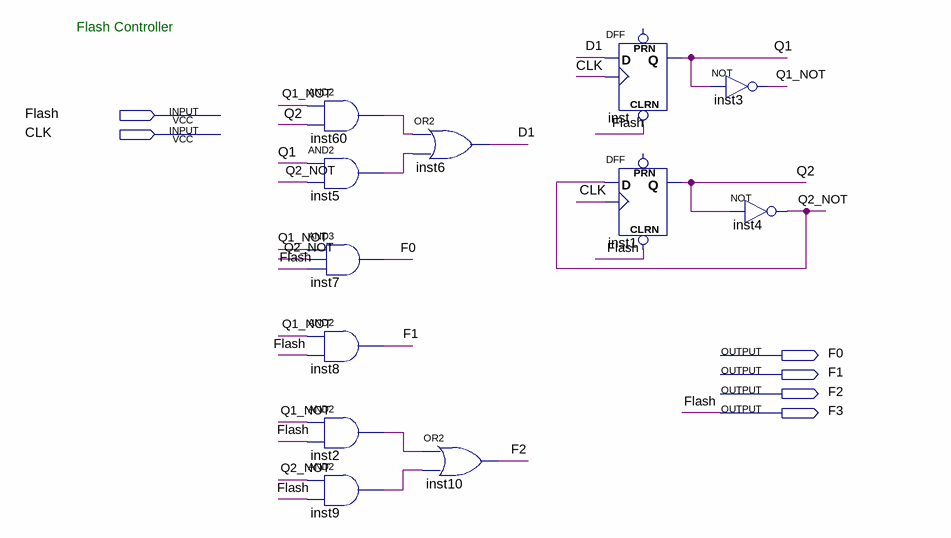
[diagram p0: schematic sheet]
// Quartus schematic FlashController.bdf as structural Verilog: 12 symbols, 6 pins
module FlashController (
  input  Flash,
  input  CLK,
  output F0,
  output F1,
  output F2,
  output F3
);

  wire D1, inst2_out, inst5_out, inst9_out, inst60_out, Q1, Q1_NOT, Q2, Q2_NOT;

  and inst60 (inst60_out, Q1_NOT, Q2);
  and inst5 (inst5_out, Q1, Q2_NOT);
  and inst7 (F0, Q1_NOT, Q2_NOT, Flash);
  and inst8 (F1, Q1_NOT, Flash);
  and inst2 (inst2_out, Q1_NOT, Flash);
  and inst9 (inst9_out, Q2_NOT, Flash);
  or inst6 (D1, inst60_out, inst5_out);
  or inst10 (F2, inst2_out, inst9_out);
  DFF inst (.CLRN(Flash), .CLK(CLK), .D(D1), .Q(Q1));  // open: PRN
  DFF inst1 (.CLRN(Flash), .CLK(CLK), .D(Q2_NOT), .Q(Q2));  // open: PRN
  not inst3 (Q1_NOT, Q1);
  not inst4 (Q2_NOT, Q2);

  assign F3 = Flash;

  // Notes on the sheet:
  //   Flash Controller
endmodule
